# EAGLE design SAFMC (EAGLE 6.2)
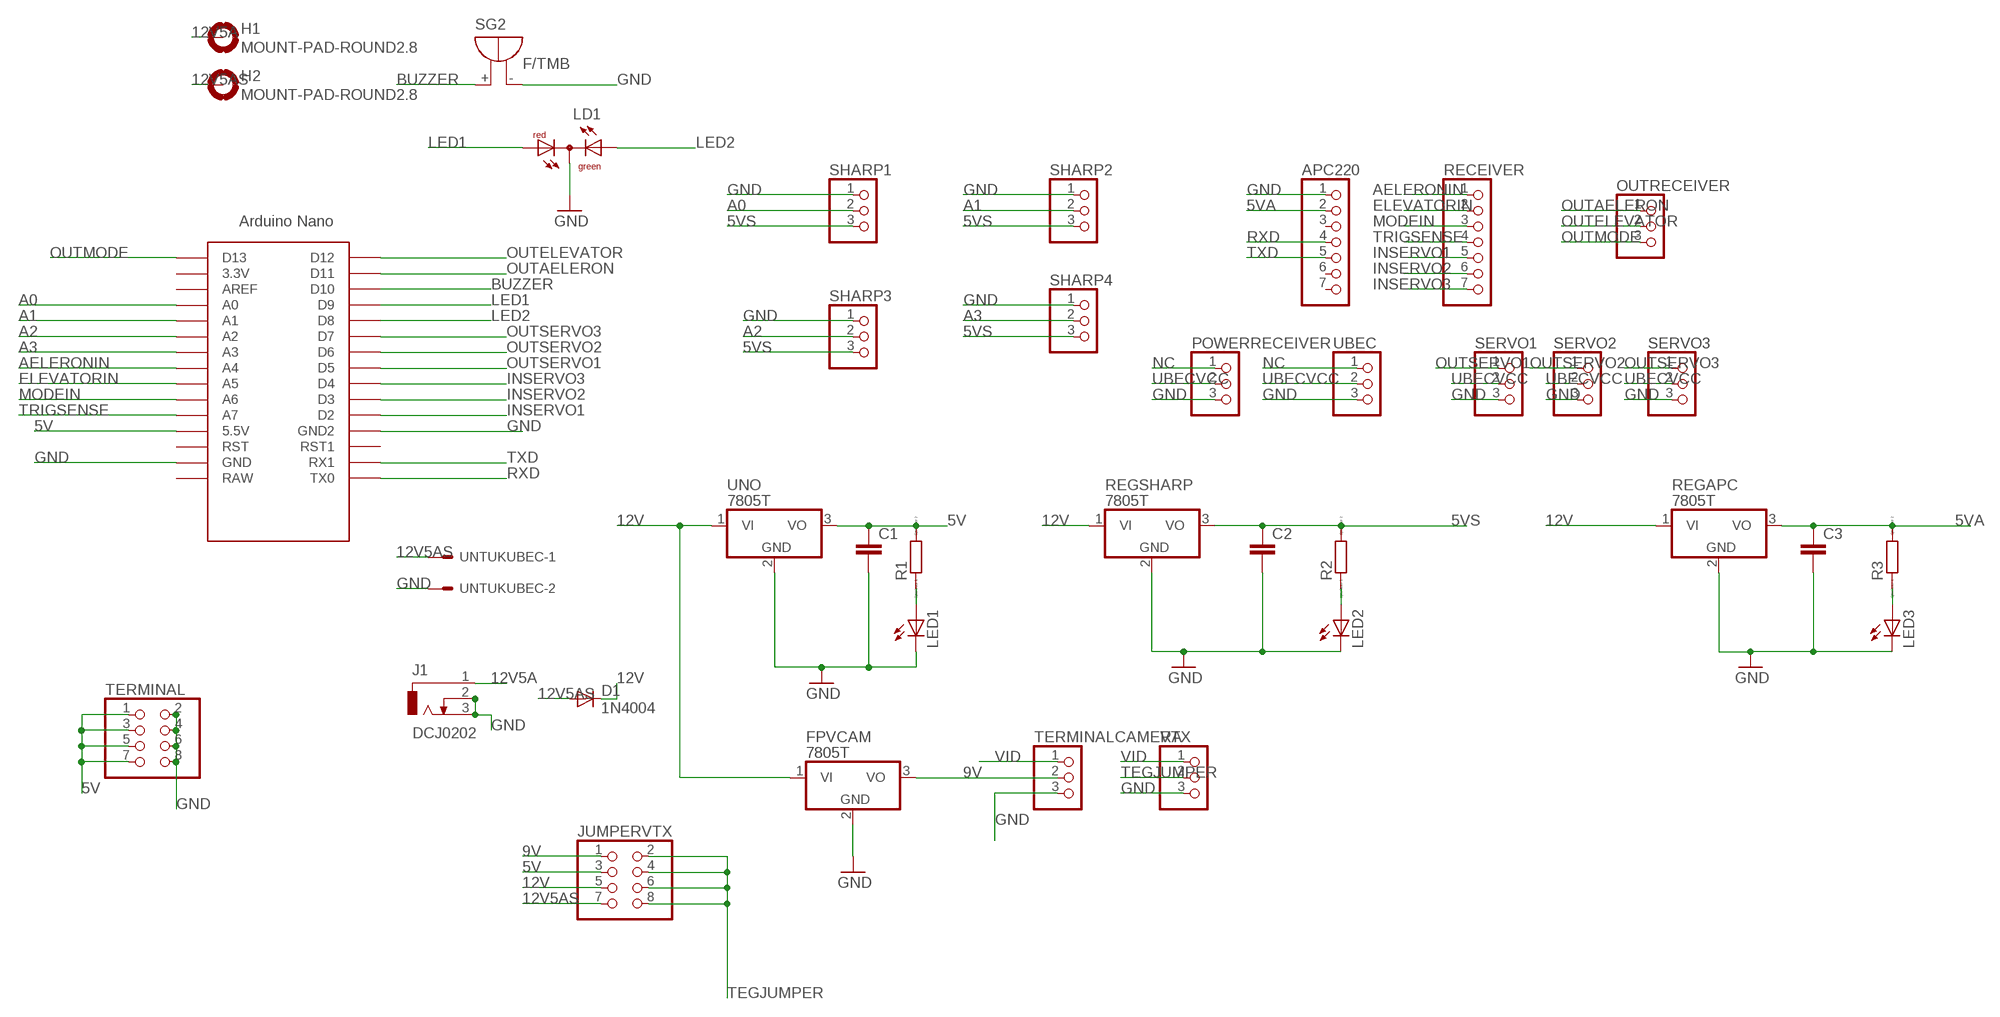
[diagram p0: schematic, sheet 1]

## Parts
APC220  PINHD-1X7  [1X07]
C1  C5/2.5  [C5B2.5]
C2  C5/2.5  [C5B2.5]
C3  C5/2.5  [C5B2.5]
D1  1N4004  [DO41-10]
FPVCAM  7805T  [TO220H]
H1  MOUNT-PAD-ROUND2.8  [2,8-PAD]
H2  MOUNT-PAD-ROUND2.8  [2,8-PAD]
J1  DCJ0202  [DCJ0202]
JUMPERVTX  PINHD-2X4  [2X04]
LD1  DUOLED-RG-C  [DUOLED-C-5MM]
LED1  LED5MM  [LED5MM]
LED2  LED5MM  [LED5MM]
LED3  LED5MM  [LED5MM]
OUTRECEIVER  PINHD-1X3  [1X03]
POWERRECEIVER  PINHD-1X3  [1X03]
R1  R0204/7  [0204/7]
R2  R0204/7  [0204/7]
R3  R0204/7  [0204/7]
RECEIVER  PINHD-1X7  [1X07]
REGAPC  7805T  [TO220H]
REGSHARP  7805T  [TO220H]
SERVO1  PINHD-1X3  [1X03]
SERVO2  PINHD-1X3  [1X03]
SERVO3  PINHD-1X3  [1X03]
SG2  F/TMB  [F/TMB]
SHARP1  PINHD-1X3  [1X03]
SHARP2  PINHD-1X3  [1X03]
SHARP3  PINHD-1X3  [1X03]
SHARP4  PINHD-1X3  [1X03]
TERMINAL  PINHD-2X4  [2X04]
TERMINALCAMERA  PINHD-1X3  [1X03]
U$2  NANO  [NANO]
UBEC  PINHD-1X3  [1X03]
UNO  7805T  [TO220H]
UNTUKUBEC  KK-156-2  [KK-156-2]
VTX  PINHD-1X3  [1X03]

## Nets
5V: C1.1 JUMPERVTX.3 R1.2 TERMINAL.1 TERMINAL.3 TERMINAL.5 TERMINAL.7 U$2.5V(5.5V) UNO.3(VO)
5VA: APC220.2 C3.1 R3.2 REGAPC.3(VO)
5VS: C2.1 R2.2 REGSHARP.3(VO) SHARP1.3 SHARP2.3 SHARP3.3 SHARP4.3
9V: FPVCAM.3(VO) JUMPERVTX.1 TERMINALCAMERA.2
12V: D1.C FPVCAM.1(VI) JUMPERVTX.5 REGAPC.1(VI) REGSHARP.1(VI) UNO.1(VI)
12V5A: H1.B2,8(MOUNT) J1.1
12V5AS: D1.A H2.B2,8(MOUNT) JUMPERVTX.7 UNTUKUBEC.1
A0: SHARP1.2 U$2.A0
A1: SHARP2.2 U$2.A1
A2: SHARP3.2 U$2.A2
A3: SHARP4.2 U$2.A3
AELERONIN: RECEIVER.1 U$2.A4
BUZZER: SG2.+ U$2.D10
ELEVATORIN: RECEIVER.2 U$2.A5
GND [baru]: APC220.1 C1.2 C2.2 C3.2 FPVCAM.2(GND) J1.2 J1.3 LD1.C LED1.K(C) LED2.K(C) LED3.K(C) POWERRECEIVER.3 REGAPC.2(GND) REGSHARP.2(GND) SERVO1.3 SERVO2.3 SERVO3.3 SG2.- SHARP1.1 SHARP2.1 SHARP3.1 SHARP4.1 TERMINAL.2 TERMINAL.4 TERMINAL.6 TERMINAL.8 TERMINALCAMERA.3 U$2.GND U$2.GND1(GND2) UBEC.3 UNO.2(GND) UNTUKUBEC.2 VTX.3
INSERVO1: RECEIVER.5 U$2.D2
INSERVO2: RECEIVER.6 U$2.D3
INSERVO3: RECEIVER.7 U$2.D4
LED1: LD1.AR U$2.D9
LED2: LD1.AX(AG) U$2.D8
MODEIN: RECEIVER.3 U$2.A6
N$2: LED3.A R3.1
N$4: LED1.A R1.1
N$16: LED2.A R2.1
NC: POWERRECEIVER.1 UBEC.1
OUTAELERON: OUTRECEIVER.1 U$2.D11
OUTELEVATOR: OUTRECEIVER.2 U$2.D12
OUTMODE: OUTRECEIVER.3 U$2.D13
OUTSERVO1: SERVO1.1 U$2.D5
OUTSERVO2: SERVO2.1 U$2.D6
OUTSERVO3: SERVO3.1 U$2.D7
RXD: APC220.4 U$2.TX0
TEGJUMPER: JUMPERVTX.2 JUMPERVTX.4 JUMPERVTX.6 JUMPERVTX.8 VTX.2
TRIGSENSE: RECEIVER.4 U$2.A7
TXD: APC220.5 U$2.RX1
UBECVCC: POWERRECEIVER.2 SERVO1.2 SERVO2.2 SERVO3.2 UBEC.2
VID: TERMINALCAMERA.1 VTX.1
Unconnected: APC220.3 APC220.6 APC220.7 U$2.3.3V U$2.AREF U$2.ICSP1 U$2.ICSP2 U$2.ICSP3 U$2.ICSP4 U$2.ICSP5 U$2.ICSP6 U$2.RAW U$2.RST U$2.RST1

## Library data of the parts
APC220 RECEIVER = pinhead:PINHD-1X7: PIN HEADER
C1-C3 = capacitor-wima:C: CAPACITOR naming: grid - package width
D1 = diode:1N4004: DIODE general purpose rectifier, 1 A
FPVCAM REGAPC REGSHARP UNO = linear:78*: Positive VOLTAGE REGULATOR Source: http://cache.national.com/ds/LM/LM78L05.pdf http://www.fairchildsemi.com/ds/LM/LM7805.pdf
H1 H2 = holes:MOUNT-PAD-ROUND: MOUNTING PAD, round
J1 = con-jack:DCJ0202: DC POWER JACK Source: DCJ0202.pdf; OC_FARNELL: unknown; OC_NEWARK: unknown
JUMPERVTX TERMINAL = pinhead:PINHD-2X4: PIN HEADER
LD1 = led:DUOLED-RG-C: DUO LED 2 colors (red/green), 5 mm, round, common Cathode www.ligitek.com or other producers.
LED1-LED3 = led:LED: LED OSRAM: - CHIPLED LG R971, LG N971, LY N971, LG Q971, LY Q971, LO R971, LY R971 LH N974, LH R974 LS Q976, LO Q976, LY Q976 LO Q996 - Hyper CHIPLED LW Q18S LB Q993, LB Q99A, LB R99A - SideLED LS A670, LO A670, LY A670, LG A670, LP A670 LB A673, LV A673, LT A673, LW A673 LH A674 LY A675 LS A676, LA A676, LO A676, LY A676, LW A676 LS A679, LY A679, LG A679 - Hyper Micro SIDELED® LS Y876, LA Y876, LO Y876, LY Y876 LT Y87S - SmartLED LW L88C, LW L88S LB L89C, LB L89S, LG L890 LS L89K, LO L89K, LY L89K LS L896, LA L896, LO L896, LY L896 - TOPLED LS T670, LO T670, LY T670, LG T670, LP T670 LSG T670, LSP T670, LSY T670, LOP T670, LYG T670 LG T671, LOG T671, LSG T671 LB T673, LV T673, LT T673, LW T673 LH T674 LS T676, LA T676, LO T676, LY T676, LB T676, LH T676, LSB T676, LW T676 LB T67C, LV T67C, LT T67C, LS T67K, LO T67K, LY T67K, LW E67C LS E67B, LA E67B, LO E67B, LY E67B, LB E67C, LV E67C, LT E67C LW T67C LS T679, LY T679, LG T679 LS T770, LO T770, LY T770, LG T770, LP T770 LB T773, LV T773, LT T773, LW T773 LH T774 LS E675, LA E675, LY E675, LS T675 LS T776, LA T776, LO T776, LY T776, LB T776 LHGB T686 LT T68C, LB T68C - Hyper Mini TOPLED® LB M676 - Mini TOPLED Santana® LG M470 LS M47K, LO M47K, LY M47K Source: http://www.osram.convergy.de LUXEON: - LUMILED® LXK2-PW12-R00, LXK2-PW12-S00, LXK2-PW14-U00, LXK2-PW14-V00 LXK2-PM12-R00, LXK2-PM12-S00, LXK2-PM14-U00 LXK2-PE12-Q00, LXK2-PE12-R00, LXK2-PE12-S00, LXK2-PE14-T00, LXK2-PE14-U00 LXK2-PB12-K00, LXK2-PB12-L00, LXK2-PB12-M00, LXK2-PB14-N00, LXK2-PB14-P00, LXK2-PB14-Q00 LXK2-PR12-L00, LXK2-PR12-M00, LXK2-PR14-Q00, LXK2-PR14-R00 LXK2-PD12-Q00, LXK2-PD12-R00, LXK2-PD12-S00 LXK2-PH12-R00, LXK2-PH12-S00 LXK2-PL12-P00, LXK2-PL12-Q00, LXK2-PL12-R00 Source: www.luxeon.com KINGBRIGHT: KA-3528ASYC Source: www.kingbright.com
OUTRECEIVER POWERRECEIVER SERVO1-SERVO3 SHARP1-SHARP4 TERMINALCAMERA UBEC VTX = pinhead:PINHD-1X3: PIN HEADER
R1-R3 = eagle-ltspice:R: RESISTOR, European symbol; SPICEMODEL: NONE; SPICEPREFIX: R
SG2 = buzzer:F/TMB: BUZZER Source: Buerklin; OC_FARNELL: unknown; OC_NEWARK: unknown
U$2 = Arduino-clone:NANO: Arduino Nano
UNTUKUBEC = con-molex:KK-156-2: KK 156 HEADER Source: http://www.molex.com/pdm_docs/sd/026604100_sd.pdf; OC_FARNELL: unknown; OC_NEWARK: unknown

## Net classes
0 default: width 0.013 mm
1 baru: width 0.013 mm, clearance 0.013 mm

## Board
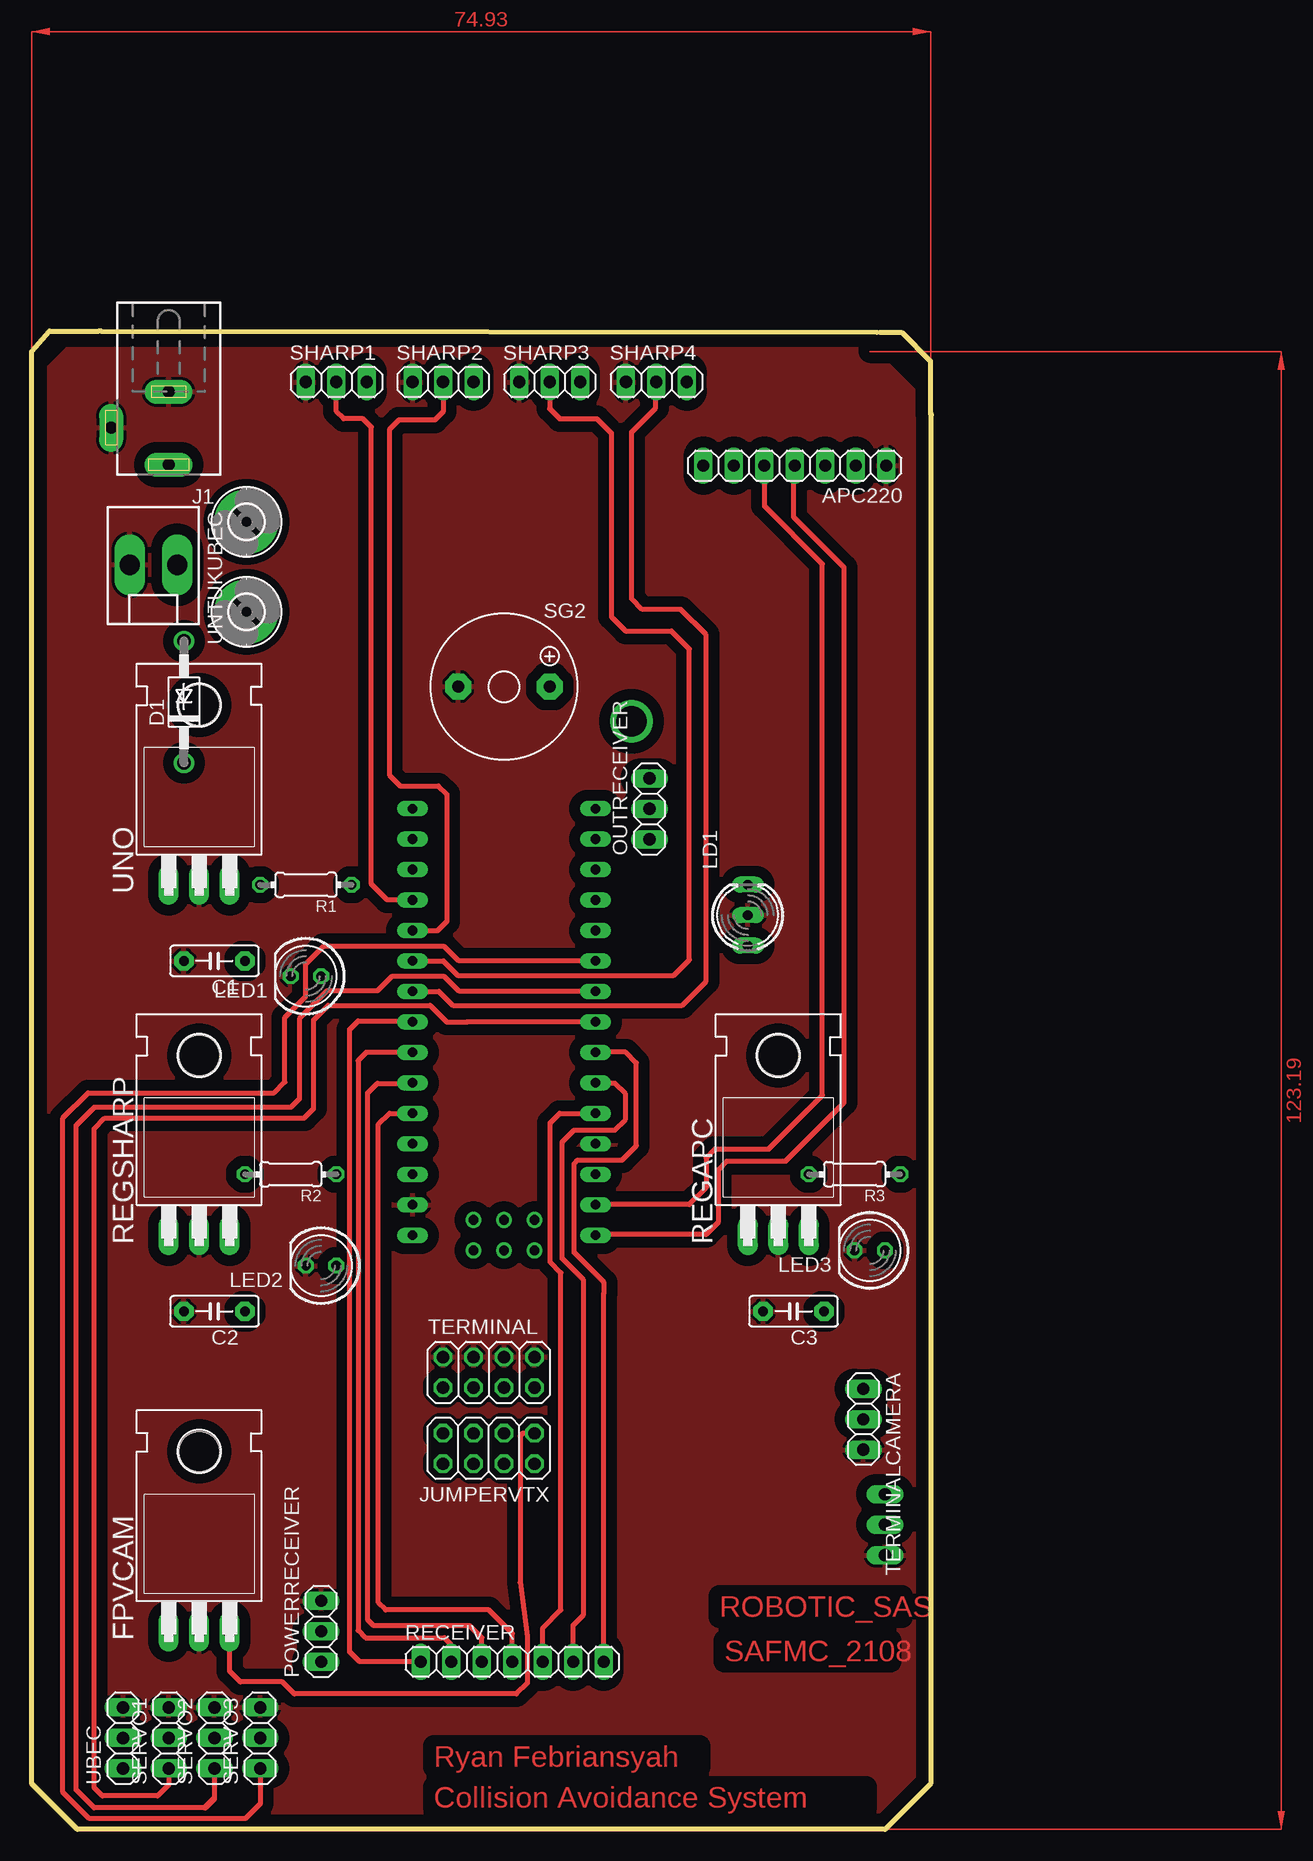
[diagram p1: board, top side]
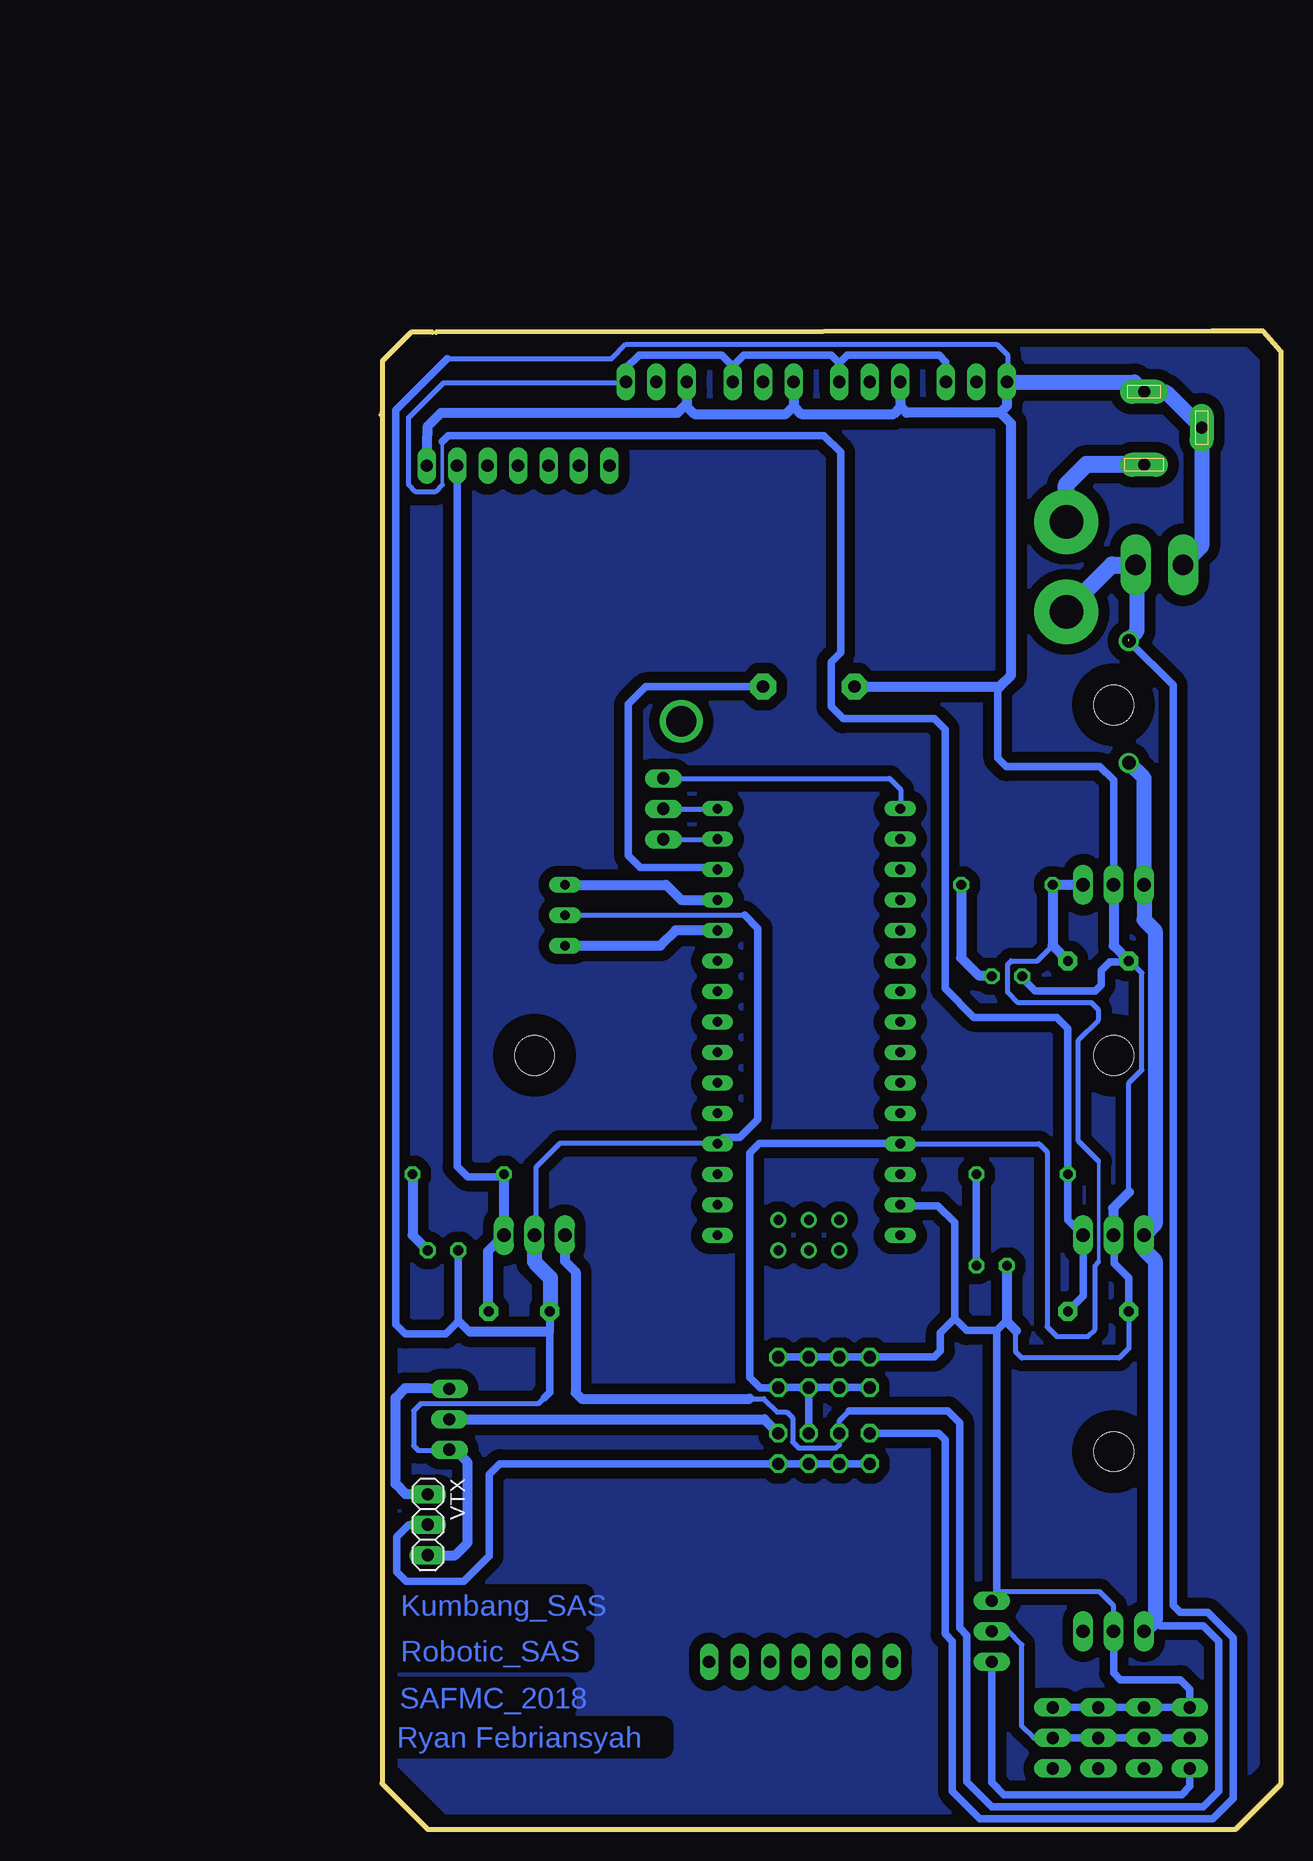
[diagram p2: board, bottom side, seen from below]

Size 75.01 x 124.89 mm. Coordinates in mm from the lower left corner, seen from the top.
Outline: 5.78,124.89 70.45,124.79
Outline: 74.93,118.11 74.93,3.81 71.12,0 3.81,0 0,3.81 0,118.11
Outline: 0.01,118.19 0.01,123.19 1.51,124.89 5.61,124.89
Outline: 70.71,124.79 72.51,124.79 74.91,122.39 74.91,117.99 75.01,117.89
Copper layers (1*16): Top 0.035mm / dielectric 1.5mm / Bottom 0.035mm
Design rules: minimum track width 10mm, minimum drill 24mil, track to track 8mil, track to pad 8mil, pad to pad 8mil, via to via 8mil, smd to smd 8mil, copper to edge 40mil, drill to drill 8mil, minimum pad ring 10mil, minimum via ring 8mil, stop-mask expansion 4mil, vias tented up to drill 0mil, thermal gap 10mil

### Footprints (pad centres in the part's own frame; a part is rotated, then mirrored left to right if it is on the bottom)
1X07 = drill 1.016 long: 1 -7.62,0; 2 -5.08,0; 3 -2.54,0; 4 0,0; 5 2.54,0; 6 5.08,0; 7 7.62,0
C5B2.5 = drill 0.813 pad 1.6 octagon: 1 -2.54,0; 2 2.54,0
DO41-10 = drill 1.118: A 5.08,0; C -5.08,0
TO220H = drill 1.118 long: 1 -2.54,-10.16; 2 0,-10.16; 3 2.54,-10.16 | hole 3.302: 0,4.826
2,8-PAD = drill 2.8 pad 5.334: B2,8 0,0
DCJ0202 = drill 1 pad 2 long: 1 0,3.1; 2 4.8,0; 3 0,-3
2X04 = drill 1.016 octagon: 1 -3.81,-1.27; 2 -3.81,1.27; 3 -1.27,-1.27; 4 -1.27,1.27; 5 1.27,-1.27; 6 1.27,1.27; 7 3.81,-1.27; 8 3.81,1.27
DUOLED-C-5MM = drill 0.813 long: AR 2.54,0; AX -2.54,0; C 0,0
LED5MM = drill 0.813 octagon: A -1.27,0; K 1.27,0
1X03 = drill 1.016 long: 1 -2.54,0; 2 0,0; 3 2.54,0
0204/7 = drill 0.813 octagon: 1 -3.81,0; 2 3.81,0
F/TMB = drill 1.016 pad 2.159 octagon: + 3.81,0; - -3.81,0
NANO = drill 0.8 long: 3.3V -10.16,24.13; 5V -10.16,-1.27; A0 -10.16,19.05; A1 -10.16,16.51; A2 -10.16,13.97; A3 -10.16,11.43; A4 -10.16,8.89; A5 -10.16,6.35; A6 -10.16,3.81; A7 -10.16,1.27; AREF -10.16,21.59; D2 5.08,1.27; D3 5.08,3.81; D4 5.08,6.35; D5 5.08,8.89; D6 5.08,11.43; D7 5.08,13.97; D8 5.08,16.51; D9 5.08,19.05; D10 5.08,21.59; D11 5.08,24.13; D12 5.08,26.67; D13 -10.16,26.67; GND -10.16,-6.35; GND1 5.08,-1.27; RAW -10.16,-8.89; RST -10.16,-3.81; RST1 5.08,-3.81; RX1 5.08,-6.35; TX0 5.08,-8.89 | drill 0.8: ICSP1 -5.08,-10.16; ICSP2 -5.08,-7.62; ICSP3 -2.54,-10.16; ICSP4 -2.54,-7.62; ICSP5 0,-10.16; ICSP6 0,-7.62
KK-156-2 = drill 1.7 pad 2.184 long: 1 -1.98,0; 2 1.98,0

### Placement (x,y rotation side)
APC220  63.6,113.67 180 top
C1  15.24,72.39 180 top
C2  15.24,43.18 180 top
C3  63.5,43.18 180 top
D1  12.7,93.98 90 top
FPVCAM  13.97,26.67 0 top
H1  17.91,108.99 0 top
H2  17.91,101.49 0 top
J1  11.43,116.84 180 top
JUMPERVTX  38.1,31.75 180 top
LD1  59.69,76.2 90 top
LED1  22.86,71.12 180 top
LED2  24.13,46.99 180 top
LED3  69.85,48.26 180 top
OUTRECEIVER  51.49,85.07 90 top
POWERRECEIVER  24.13,16.51 90 top
R1  22.86,78.74 180 top
R2  21.59,54.61 180 top
R3  68.58,54.61 180 top
RECEIVER  40.06,13.97 0 top
REGAPC  62.23,59.69 0 top
REGSHARP  13.97,59.69 0 top
SERVO1  11.43,7.62 90 top
SERVO2  15.24,7.62 90 top
SERVO3  19.05,7.62 90 top
SG2  39.37,95.25 0 top
SHARP1  25.4,120.65 0 top
SHARP2  34.29,120.65 0 top
SHARP3  43.18,120.65 0 top
SHARP4  52.07,120.65 0 top
TERMINAL  38.1,38.1 0 top
TERMINALCAMERA  69.32,34.19 270 top
U$2  41.91,58.42 0 top
UBEC  7.62,7.62 90 top
UNO  13.97,88.9 0 top
UNTUKUBEC  10.16,105.41 180 top
VTX  71.12,25.4 270 bottom

### Tracks (layer width: path | path; a pad name or v marks a point on that pad's centre or on a via)
5V
  Bottom 0.3: 15.21,47.29 15.21,55.69
  Bottom 0.406: U$2.5V 20.17,57.15 19.51,56.49 19.51,41.89 18.71,41.09 16.11,41.09 15.51,41.69 15.51,46.99 15.21,47.29 | 19.05,73.66 20.32,72.39 22.51,72.39 22.81,72.09 22.81,69.79 21.91,68.89 15.81,68.89 15.21,68.29 15.21,67.49 16.91,65.79 16.91,57.39 15.21,55.69
  Bottom 0.61: TERMINAL.5 TERMINAL.3 TERMINAL.1 41.97,36.83 42.01,36.79 43.41,36.79 44.31,37.69 44.31,56.39 43.51,57.19 31.79,57.19 U$2.5V | TERMINAL.5 TERMINAL.7 | JUMPERVTX.3 TERMINAL.5
  Bottom 0.813: C1.1 19.05,73.66 R1.2 UNO.3
5VA
  Bottom 0.61: APC220.2 68.68,55.26 67.81,54.39 64.99,54.39 R3.2
  Bottom 0.813: C3.1 66.11,43.25 66.11,48.19 REGAPC.3 R3.2
5VS
  Bottom 0.3: 69.91,115.69 69.91,112.09
  Bottom 0.406: 69.91,112.09 70.51,111.49 72.11,111.49 72.71,112.09 72.71,117.69 69.81,120.59 54.67,120.59 SHARP4.3
  Bottom 0.61: SHARP4.3 54.61,121.79 53.51,122.89 46.61,122.89 45.71,121.99 | 45.71,121.99 SHARP3.3 | SHARP2.3 36.83,122.21 | 36.83,122.21 37.51,122.89 44.81,122.89 45.71,121.99 | SHARP1.3 27.94,122.32 28.51,122.89 36.15,122.89 36.83,122.21 | C2.1 16.51,44.45 REGSHARP.3 17.78,50.8 R2.2 17.78,66.76 18.71,67.69 25.61,67.69 28.01,70.09 28.01,91.69 28.91,92.59 36.51,92.59 37.51,93.59 37.51,97.29 36.71,98.09 36.71,114.79 38.11,116.19 69.41,116.19 69.91,115.69
9V
  Top 0.406: JUMPERVTX.1 40.94,33.02 40.71,32.79 40.71,20.59 41.31,16.09 41.31,12.19 40.41,11.29 21.91,11.29 20.91,12.29 17.41,12.29 16.51,13.19 FPVCAM.3
  Bottom 0.406: JUMPERVTX.1 42.14,33.02 43.11,33.99
  Bottom 0.813: TERMINALCAMERA.2 43.08,34.19 JUMPERVTX.1
12V
  Bottom 0.406: 44.31,35.89 43.11,35.89 42.01,34.79 41.21,34.79 40.71,34.29 40.71,32.29 40.21,31.79 37.11,31.79 36.81,32.09 36.81,33 JUMPERVTX.5 36.83,34.07 36.01,34.89
  Bottom 0.61: 36.01,34.89 27.81,34.89 26.81,33.89 26.81,16.79 26.21,16.19 26.21,3.99 24.11,1.89 6.51,1.89 5.21,3.19 5.21,15.69 6.51,16.99 10.07,16.99 10.51,17.43
  Bottom 0.813: REGAPC.1 59.69,47.37 58.81,46.49 58.81,36.39 58.31,35.89 44.31,35.89
  Bottom 1.27: D1.C 11.43,87.63 UNO.1 11.43,75.81 10.51,74.89 10.51,50.45 REGSHARP.1 11.43,48.31 10.51,47.39 10.51,17.43 FPVCAM.1
12V5A
  Bottom 1.422: H1.B2,8 17.91,112.09 16.21,113.79 11.48,113.79 J1.1
12V5AS  (1 unrouted)
  Bottom 0.61: JUMPERVTX.7 28.54,33.02 28.01,32.49 28.01,16.29 27.41,15.69 27.41,3.19 25.11,0.89 5.71,0.89 4.01,2.59 4.01,15.99 6.11,18.09 8.41,18.09 9.01,18.69 9.01,95.37 D1.A
  Bottom 1.27: 12.7,99.2 12.01,99.89 12.01,105.28 UNTUKUBEC.1
  Bottom 1.422: H2.B2,8 17.91,101.59 14.11,105.39 12.16,105.39 UNTUKUBEC.1
A0
  Top 0.406: U$2.A0 29.63,77.47 28.31,78.79 28.31,116.89 27.61,117.59 26.01,117.59 25.41,118.19 SHARP1.2
A1
  Top 0.406: SHARP2.2 34.29,118.17 33.61,117.49 30.61,117.49 29.81,116.69 29.81,87.89 30.71,86.99 33.91,86.99 34.61,86.29 34.61,75.69 33.81,74.89 31.79,74.89 U$2.A1
A2
  Top 0.406: SHARP3.2 43.18,118.42 44.01,117.59 47.11,117.59 48.31,116.39 48.31,101.09 49.51,99.89 53.31,99.89 54.81,98.39 54.81,72.49 53.51,71.19 35.51,71.19 34.31,72.39 U$2.A2
A3
  Top 0.406: U$2.A3 33.95,69.85 35.11,68.69 54.21,68.69 56.21,70.69 56.21,99.59 54.11,101.69 50.91,101.69 50.01,102.59 50.01,116.49 52.01,118.49 52.01,120.59 SHARP4.2
AELERONIN
  Top 0.406: RECEIVER.1 27.33,13.97 26.51,14.79 26.51,66.69 27.21,67.39 31.67,67.39 U$2.A4
BUZZER
  Bottom 0.61: SG2.+ 52.95,95.25 54.41,93.79 54.41,81.19 53.41,80.19 47.17,80.19 U$2.D10
ELEVATORIN
  Top 0.406: U$2.A5 27.89,64.77 27.21,64.09 27.21,16.59 27.81,15.99 34.41,15.99 34.91,15.49 34.91,14.04 RECEIVER.2
GND
  Bottom 0.406: 69.01,31.79 69.15,31.65 TERMINALCAMERA.3 69.38,31.59 71.91,31.59 72.31,31.99 72.31,34.89 71.71,35.49 61.91,35.49 61.41,35.99 | C2.2 12.7,40.1 13.51,39.29 21.61,39.29 22.11,39.79 22.11,41.59 | 69.51,122.59 55.81,122.59 54.61,123.79 23.71,123.79 22.81,122.89 22.81,120.7 SHARP1.1 | LD1.C 44.72,76.2 | 45.11,57.69 46.51,57.69 47.01,57.19 60.11,57.19 62.11,55.19 62.11,49.11 62.23,48.99 | FPVCAM.2 13.97,18.65 15.11,19.79 23.61,19.79 23.71,19.89 | 12.7,53.1 12.7,62.2 11.61,63.29 11.61,71.39 12.71,72.49 12.81,72.39
  Bottom 0.61: C2.2 12.7,45.98 13.91,47.19 13.91,49.47 REGSHARP.2 | SERVO3.3 SERVO2.3 SERVO1.3 UBEC.3 7.61,11.69 8.41,12.49 13.41,12.49 13.97,13.05 FPVCAM.2 | TERMINAL.8 TERMINAL.6 TERMINAL.4 TERMINAL.2 28.93,39.37 28.41,39.89 28.41,41.39 27.21,42.59 | 8.11,105.34 UNTUKUBEC.2 | LED1.K 21.59,70.97 20.51,69.89 15.51,69.89 15.01,70.39 15.01,71.59 14.31,72.29 12.8,72.29 C1.2 | C3.2 60.96,41.29 | 60.96,41.29 60.96,36.44 61.41,35.99 | UNO.2 13.97,87.45 15.11,88.59 22.91,88.59 23.61,89.29 23.61,95.09 23.61,95.25 | LED2.K 22.86,42.44 23.71,41.59 | 23.71,41.59 26.21,41.59 27.21,42.59 | 27.21,42.59 27.21,50.59 28.61,51.99 31.67,51.99 U$2.GND | 47.13,57.29 U$2.GND1 46.45,57.69 45.11,57.69 43.61,59.19 43.61,75.09 44.72,76.2 | 23.71,41.59 23.71,19.89 23.71,19.47 POWERRECEIVER.3 | LED3.K 68.58,42.46 67.71,41.59 61.26,41.59 60.96,41.29 | 62.31,47.29 61.01,45.99 61.01,43.09 60.91,42.99 60.91,41.49 61.01,41.39 67.61,41.39 68.61,42.39 68.61,42.29 69.61,41.29 73.01,41.29 73.81,42.09 73.81,118.29 69.51,122.59
  Bottom 0.813: UNO.2 13.97,73.66 C1.2 | 12.7,53.1 14.01,51.79 14.01,49.57 REGSHARP.2 | LED2.K 22.86,42.34 22.11,41.59 | 31.81,120.59 SHARP2.1 31.71,120.61 31.71,118.59 | SHARP1.1 22.86,118.64 23.41,118.09 | SHARP3.1 40.64,118.62 | 40.64,118.62 40.01,117.99 32.31,117.99 31.71,118.59 | SHARP4.1 49.53,118.61 | 49.53,118.61 48.91,117.99 41.27,117.99 40.64,118.62 | 49.53,118.61 49.79,118.61 50.31,118.09 70.01,118.09 71.12,116.98 APC220.1 | VTX.3 68.84,22.86 67.81,23.89 67.81,30.59 69.01,31.79 | 23.41,118.09 31.21,118.09 31.71,118.59 | 23.61,95.25 23.45,95.25 22.51,96.19 22.51,117.19 23.41,118.09 | SG2.- 23.77,95.25 23.61,95.09
  Bottom 1.27: UNTUKUBEC.2 6.63,106.96 J1.2 9.63,119.84 J1.3 12.24,120.65 SHARP1.1 | REGAPC.2 62.23,48.99 62.23,47.31 60.91,45.99 60.91,43.23 C3.2
  pour Top (isolate 0.9): 2.01,122.39 3.01,123.39 70.01,123.39 74.01,119.39 74.01,4.39 71.01,1.39 4.01,1.39 1.51,3.89 1.51,121.89
INSERVO1
  Top 0.406: RECEIVER.5 42.6,16.78 44.11,18.29 44.11,46.39 43.21,47.29 43.21,58.89 44.01,59.69 U$2.D2
INSERVO2
  Top 0.406: RECEIVER.6 45.14,17.02 46.01,17.89 46.01,45.79 44.21,47.59 44.21,57.29 45.21,58.29 48.61,58.29 49.51,59.19 49.51,61.29 48.61,62.19 47.03,62.19 U$2.D3
INSERVO3
  Top 0.406: RECEIVER.7 47.68,44.66 47.71,44.69 47.71,45.59 45.21,48.09 45.21,55.49 45.51,55.79 49.21,55.79 50.41,56.99 50.41,63.89 49.51,64.79 47.01,64.79 U$2.D4
LED1
  Bottom 0.813: LD1.AR 51.26,78.74 50.01,77.49 47.01,77.49 U$2.D9
LED2
  Bottom 0.813: LD1.AX 51.74,73.66 50.47,74.93 U$2.D8
MODEIN
  Top 0.406: RECEIVER.3 37.52,15.98 36.51,16.99 28.51,16.99 28.01,17.49 28.01,61.39 28.81,62.19 31.71,62.19 U$2.A6
N$1  (via drill 2.54 pad 0.25)
  other vias: 50,92.37
N$2
  Bottom 0.813: R3.1 72.39,49.53 LED3.A
N$3
  pour Bottom (isolate 0.9): 2.01,122.39 2.01,5.39 6.01,1.39 69.51,1.39 73.51,5.39 73.51,120.39 70.51,123.39 3.01,123.39
N$4
  Bottom 0.813: R1.1 26.67,72.65 25.21,71.19 24.2,71.19 LED1.A
N$16
  Bottom 0.61: R2.1 LED2.A
NC
  Bottom 0.61: POWERRECEIVER.1 24.13,3.91 23.11,2.89 8.31,2.89 7.61,3.59 UBEC.1
OUTAELERON
  Bottom 0.406: OUTRECEIVER.1 47.01,82.53 U$2.D11
OUTELEVATOR
  Bottom 0.406: OUTRECEIVER.2 47.01,85.07 U$2.D12
OUTMODE
  Bottom 0.406: OUTRECEIVER.3 32.63,87.61 31.71,86.69 31.71,85.13 U$2.D13
OUTSERVO1
  Top 0.406: U$2.D5 36.29,67.31 36.27,67.29 34.61,67.29 33.21,68.69 24.71,68.69 23.51,67.49 23.51,60.09 22.71,59.29 6.11,59.29 5.21,58.39 5.21,3.49 5.91,2.79 10.51,2.79 11.43,3.71 SERVO1.1
OUTSERVO2
  Top 0.406: U$2.D6 35.65,69.85 34.41,71.09 30.01,71.09 28.81,69.89 24.61,69.89 22.31,67.59 22.31,60.89 21.61,60.19 5.21,60.19 3.71,58.69 3.71,3.29 5.21,1.79 14.41,1.79 | 14.41,1.79 14.51,1.79 15.24,2.52 SERVO2.1 15.24,2.62 14.41,1.79
OUTSERVO3
  Top 0.406: U$2.D7 35.61,72.39 34.41,73.59 24.31,73.59 22.81,72.09 22.81,69.39 21.11,67.69 21.11,62.29 20.21,61.39 4.71,61.39 2.61,59.29 2.61,3.09 4.81,0.89 17.81,0.89 19.05,2.13 SERVO3.1
RXD
  Top 0.406: U$2.TX0 47.05,49.59 56.21,49.59 57.21,50.59 57.21,54.99 57.91,55.69 62.81,55.69 67.71,60.59 67.71,105.19 63.51,109.39 63.51,113.58 APC220.4
TEGJUMPER
  Bottom 0.61: JUMPERVTX.8 JUMPERVTX.6 JUMPERVTX.4 JUMPERVTX.2 65.11,30.49 66.01,29.59 66.01,22.79 68.11,20.69 72.91,20.69 73.71,21.49 73.71,24.39 72.7,25.4 VTX.2
TRIGSENSE
  Top 0.406: RECEIVER.4 40.06,16.34 38.11,18.29 29.51,18.29 28.91,18.89 28.91,58.79 29.81,59.69 U$2.A7
TXD
  Top 0.406: APC220.5 61.06,110.34 65.91,105.49 65.91,61.19 61.41,56.69 56.91,56.69 56.21,55.99 56.21,53.49 54.81,52.09 47.01,52.09 U$2.RX1
UBECVCC
  Bottom 0.406: SERVO3.2 20.64,7.62 21.61,8.59 21.61,15.39 22.81,16.59 24.05,16.59 POWERRECEIVER.2
  Bottom 0.61: UBEC.2 SERVO1.2 SERVO2.2 SERVO3.2
VID
  Bottom 0.813: VTX.1 72.96,27.94 73.81,28.79 73.81,35.99 73.01,36.79 71.16,36.79 TERMINALCAMERA.1
(copper drawn outside any net)
  shapes: Top area x2

### Text on the board
Top: ROBOTIC_SAS | SAFMC_2108 | Ryan Febriansyah | Collision Avoidance System
Bottom: Kumbang_SAS | Robotic_SAS | SAFMC_2018 | Ryan Febriansyah